# EAGLE design rough (EAGLE 6.5.0)
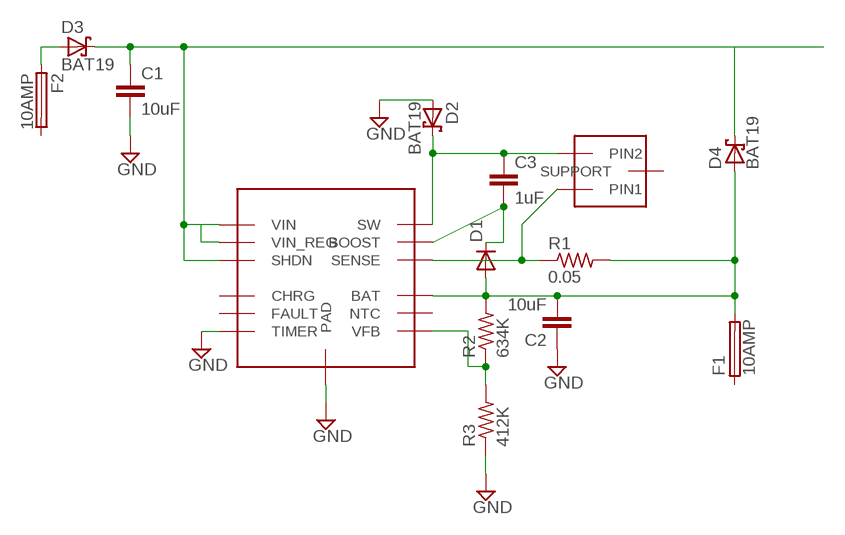
[diagram p0: schematic, sheet 1]

## Parts
C1  10uF  C5/3.5  [C5B3.5]
C2  10uF  C5/3.5  [C5B3.5]
C3  1uF  C5/3.5  [C5B3.5]
D1  DIODE-SOD80C  [SOD80C]
D2  BAT19  [DO35-10]
D3  BAT19  [DO35-10]
D4  BAT19  [DO35-10]
F1  10AMP  SH22,5  [SH22,5]
F2  10AMP  SH22,5  [SH22,5]
INDUCTOR  INDUCTOR  [3LEADINDUCTOR]
R1  0.05  R-US_R1206  [R1206]
R2  634K  R-US_M2012  [M2012]
R3  412K  R-US_M2012  [M2012]
U$1  LT3652  [DD-12-LEAD-3MMX3MM]

## Nets
GND: C1.2 C2.1 D2.A R3.1 U$1.P$1(PAD) U$1.TIMER
N$1: C1.1 D3.C D4.C U$1.SHDN U$1.V_IN(VIN) U$1.VIN_REG
N$2: C2.2 D1.A D4.A F1.2 R1.2 R2.2 U$1.BAT
N$3: INDUCTOR.PIN1 R1.1 U$1.SENSE
N$4: C3.1 D2.C INDUCTOR.PIN2 U$1.SW
N$5: C3.2 D1.C U$1.BOOST
N$6: R2.1 R3.2 U$1.VFB
N$7: D3.A F2.1
Unconnected: F1.1 F2.2 INDUCTOR.SUPPORT U$1.CHRG U$1.FAULT U$1.NTC

## Library data of the parts
C1-C3 = capacitor-wima:C: CAPACITOR naming: grid - package width
D1 = diode:DIODE-: DIODE
D2-D4 = diode:BAT19: DIODE barrier diode
F1 F2 = fuse:SH22,5: FUSE HOLDER grid 22,5 mm, OGN0031 8201, Schurter (Buerklin); MF: SCHURTER; MPN: 0031.8201; OC_FARNELL: 1162740; OC_NEWARK: 96F8317
INDUCTOR = Test:INDUCTOR
R1 = resistor:R-US_: RESISTOR, American symbol
R2 R3 = rcl:R-US_: RESISTOR, American symbol
U$1 = Test:LT3652

## Board
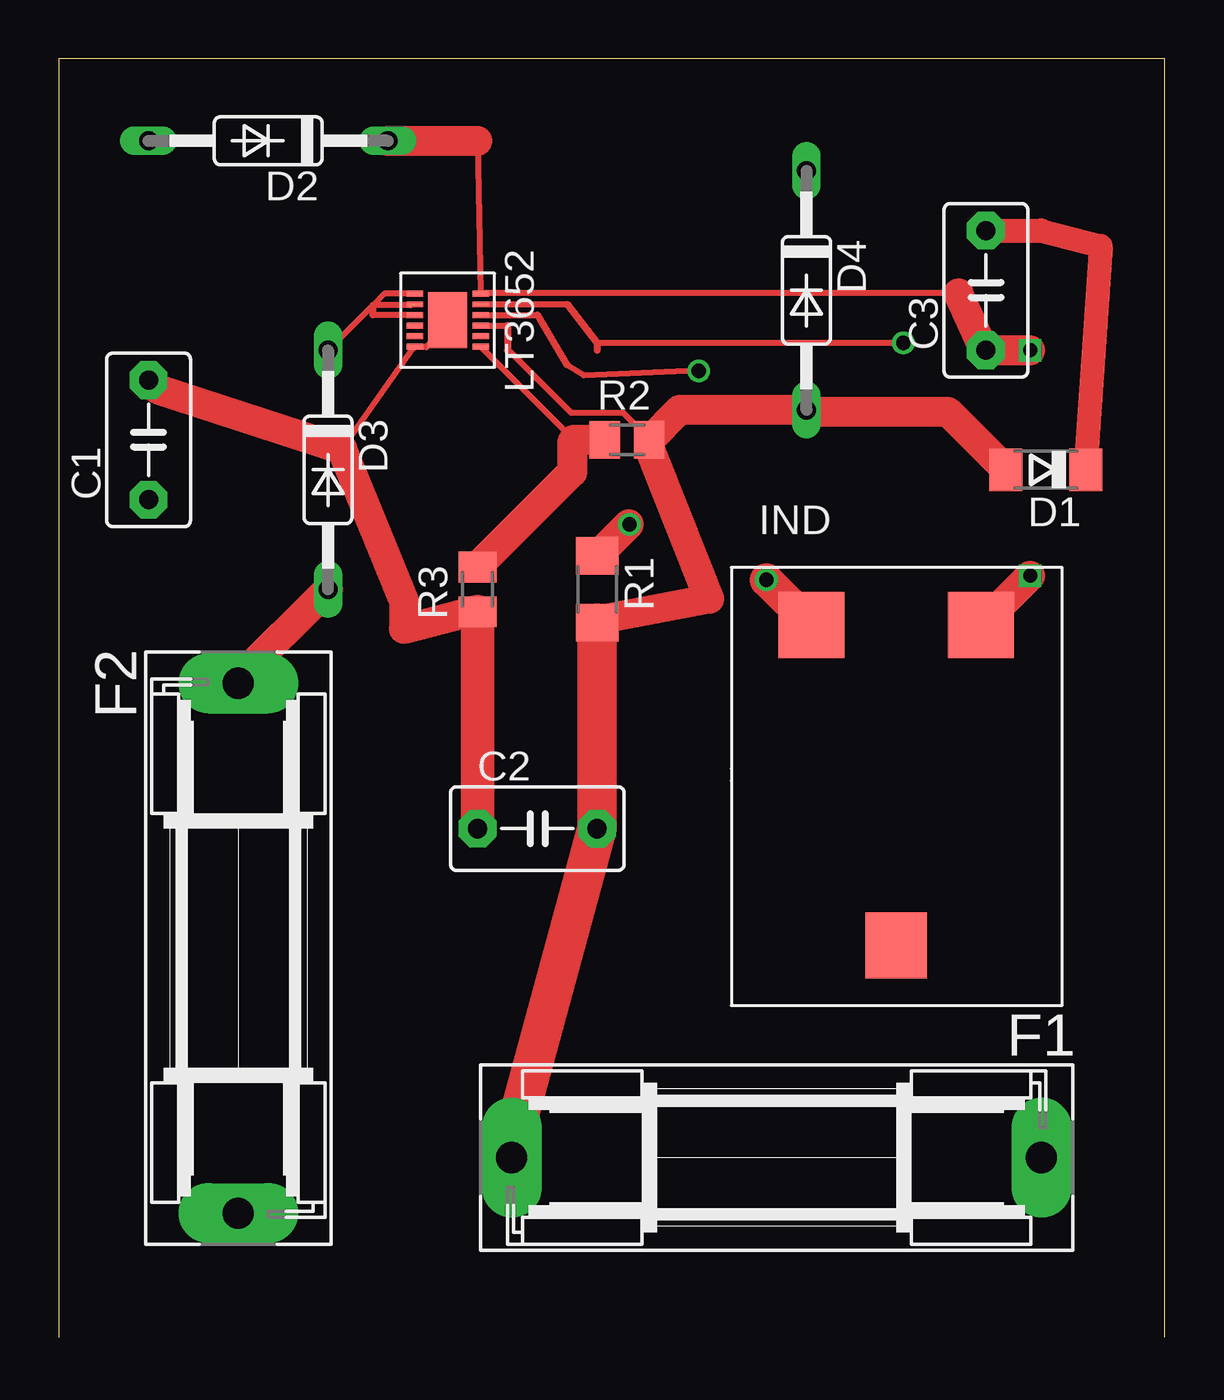
[diagram p1: board, top side]
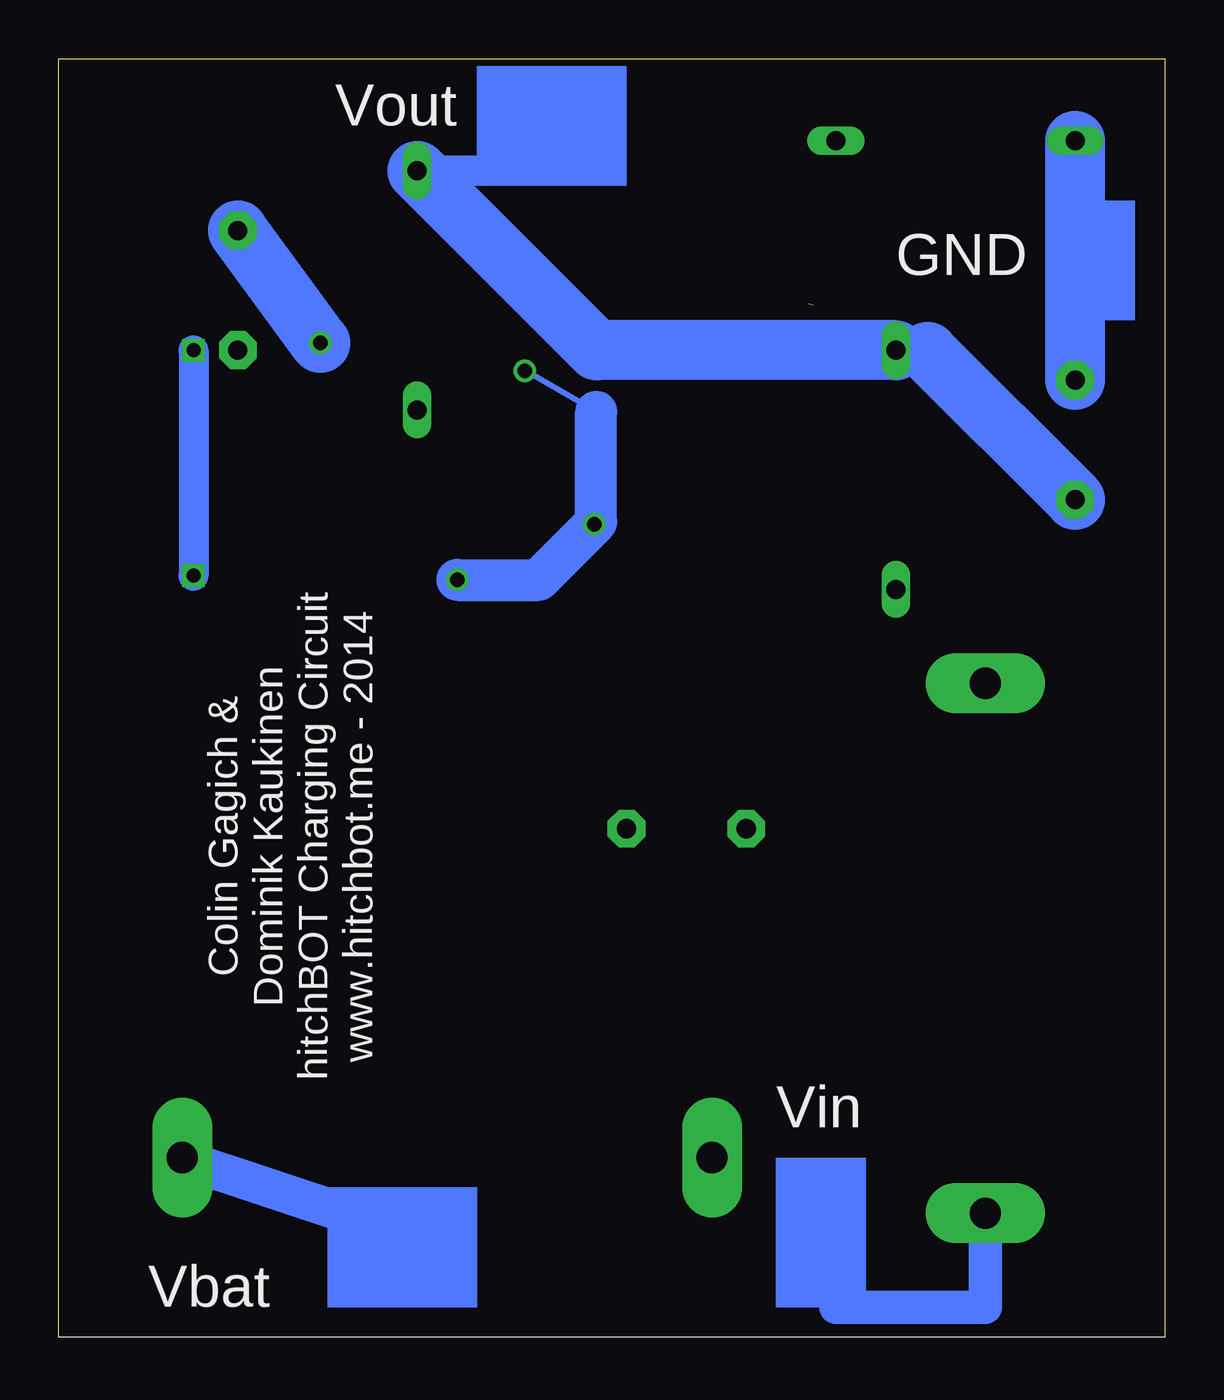
[diagram p2: board, bottom side, seen from below]

Size 46.97 x 54.28 mm. Coordinates in mm from the lower left corner, seen from the top.
Outline: 46.97,0 46.97,54.28 0,54.28 0,0
Copper layers (1*16): Top 0.0356mm / dielectric 1.5011mm / Bottom 0.0356mm
Design rules "LaenPCBOrder": minimum track width 6mil, minimum drill 13mil, track to track 6mil, track to pad 6mil, pad to pad 6mil, via to via 6mil, smd to smd 6mil, copper to edge 15mil, drill to drill 6mil, minimum pad ring 7mil, minimum via ring 7mil, stop-mask expansion 3mil, vias tented up to drill 0mil, thermal gap 10mil

### Footprints (pad centres in the part's own frame; a part is rotated, then mirrored left to right if it is on the bottom)
C5B3.5 = drill 0.813 pad 1.6 octagon: 1 -2.54,0; 2 2.54,0
SOD80C = smd 1.4 x 1.8: A 1.7,0; C -1.7,0
DO35-10 = drill 0.813 long: A 5.08,0; C -5.08,0
SH22,5 = drill 1.321 pad 2.54 long: 1 -11.252,0; 2 11.252,0
3LEADINDUCTOR = smd 2.8 x 2.8: PIN1 -3.6,6.1; PIN2 3.6,6.1 | smd 2.6 x 2.8: SUPPORT 0,-7.5
R1206 = smd 1.6 x 1.803: 1 -1.422,0; 2 1.422,0
M2012 = smd 1.3 x 1.6: 1 -0.95,0; 2 0.95,0
DD-12-LEAD-3MMX3MM = smd 0.25 x 0.7: BAT 0.225,1.4; BOOST -0.675,1.4; CHRG 0.225,-1.4; FAULT 0.675,-1.4; NTC 0.675,1.4; SENSE -0.225,1.4; SHDN -0.225,-1.4; SW -1.125,1.4; TIMER 1.125,-1.4; V_IN -1.125,-1.4; VFB 1.125,1.4; VIN_REG -0.675,-1.4 | smd 2.38 x 1.65: P$1 0,0

### Placement (x,y rotation side)
C1  3.81,38.1 90 top
C2  20.32,21.59 0 top
C3  39.37,44.45 90 top
D1  41.91,36.83 180 top
D2  8.89,50.8 180 top
D3  11.43,36.83 270 top
D4  31.75,44.45 270 top
F1  30.48,7.62 180 top
F2  7.62,16.51 270 top
INDUCTOR  35.56,24.13 0 top
R1  22.86,31.75 270 top
R2  24.13,38.1 0 top
R3  17.78,31.75 90 top
U$1  16.51,43.18 270 top

### Tracks (layer width: path | path; a pad name or v marks a point on that pad's centre or on a via)
GND
  Top 0.254: U$1.P$1 16.51,42.95 15.6,42.04 15.11,42.04 U$1.TIMER 15.01,41.96 12.04,37.72 | C1.2 4.19,40.26 | 17.68,30.86 R3.1
  Top 1.27: 4.19,40.26 12.04,37.72 14.66,31.27 14.66,30.07 17.68,30.86
  Top 1.422: C2.1 R3.1
  Bottom 2.54: C1.2 D2.A
N$1  (1 unrouted)
  Top 0.254: D3.C 13.34,43.81 | 13.34,43.81 13.84,44.32 15.09,44.32 U$1.V_IN | U$1.SHDN 13.34,43.41 | 14.92,43.81 13.34,43.81
  Top 0.305: 13.34,43.41 13.34,43.81
  Bottom 0.254: 10.08,41.83 11.33,41.83 D3.C
  Bottom 1.27: 29.21,49.53 D4.C
  Bottom 2.54: D4.C 24.13,41.91 D3.C | 10.08,41.83 C1.1
N$2
  Top 0.254: F1.2 19.05,7.62 | 25.09,38.1 R2.2 | D1.A | 31.85,39.29 D4.A | 25.43,38 25.17,38 R2.2 | U$1.BAT 19.05,42.95 | 19.05,41.91 19.18,41.83 21.77,39.24 23.98,39.24 25.02,38.2 R2.2 | 25.09,37.9 R2.2 | 22.91,30.45 R1.2 | 25.07,37.77 R2.2
  Top 0.305: 19.05,42.95 19.05,41.91
  Top 1.27: 25.09,38.1 26.36,39.37 D4.A | D1.A 37.74,39.29 31.85,39.29 | 22.91,30.45 27.61,31.34 25.07,37.77
  Top 1.676: 19.05,7.62 C2.2 R1.2
N$3  (via drill 0.61)
  Top 0.254: v24.23,34.52 24.21,34.52 | 31.95,30.25 INDUCTOR.PIN1 | U$1.SENSE 20.32,43.41 | v27.18,41.03 22.3,40.83 21.59,41.27 | R1.1
  Top 0.305: 20.32,43.41 21.59,41.27
  Top 1.27: 24.21,34.52 R1.1
  Top 1.422: 31.95,30.25 v30.05,32.16
  Bottom 0.254: 24.16,39.29 v27.18,41.03 | 24.16,34.62 v24.23,34.52
  Bottom 1.778: v24.23,34.52 26.59,32.16 v30.05,32.16 | 24.16,34.62 24.16,39.29
N$4  (via drill 0.6)
  Top 0.254: 17.78,50.8 17.91,44.32 U$1.SW 18.03,44.32 38.2,44.32 | 39.17,30.25 INDUCTOR.PIN2 | 39.27,41.99 C3.1
  Top 1.27: D2.C 17.78,50.8 | v41.25,32.33 39.17,30.25 | C3.1 v41.25,41.91 | 39.27,41.99 38.2,44.32
  Bottom 1.27: v41.25,41.91 v41.25,32.33
N$5  (via drill 0.61)
  Top 0.254: 43.59,36.83 D1.C | U$1.BOOST 21.59,43.85 | v35.87,42.22 22.86,42.22
  Top 0.305: 21.59,43.85 22.86,42.22 22.86,41.91
  Top 1.016: 43.59,36.83 44.25,46.33 41.71,46.99 C3.2
  Bottom 2.54: C3.2 v35.87,42.22
N$6
  Top 0.254: U$1.VFB 17.93,42.04 21.87,38.1 21.79,38 | 17.78,32.72 R3.2
  Top 1.27: R2.1 21.87,38.1 | 17.78,32.72 21.79,36.73 21.79,38
N$7
  Top 0.254: F2.1 7.62,27.94
  Top 1.27: 7.62,27.94 D3.A
N$8
  Bottom 1.676: 41.91,7.62 34.29,5.08
N$9
  Bottom 1.422: 7.62,5.08 7.62,1.27 13.97,1.27
(copper drawn outside any net)
  shapes: Bottom area x4

### Text on the board
bPlace: Vout | GND | Colin Gagich & / Dominik Kaukinen / hitchBOT Charging Circuit / www.hitchbot.me - 2014 | Vin | Vbat